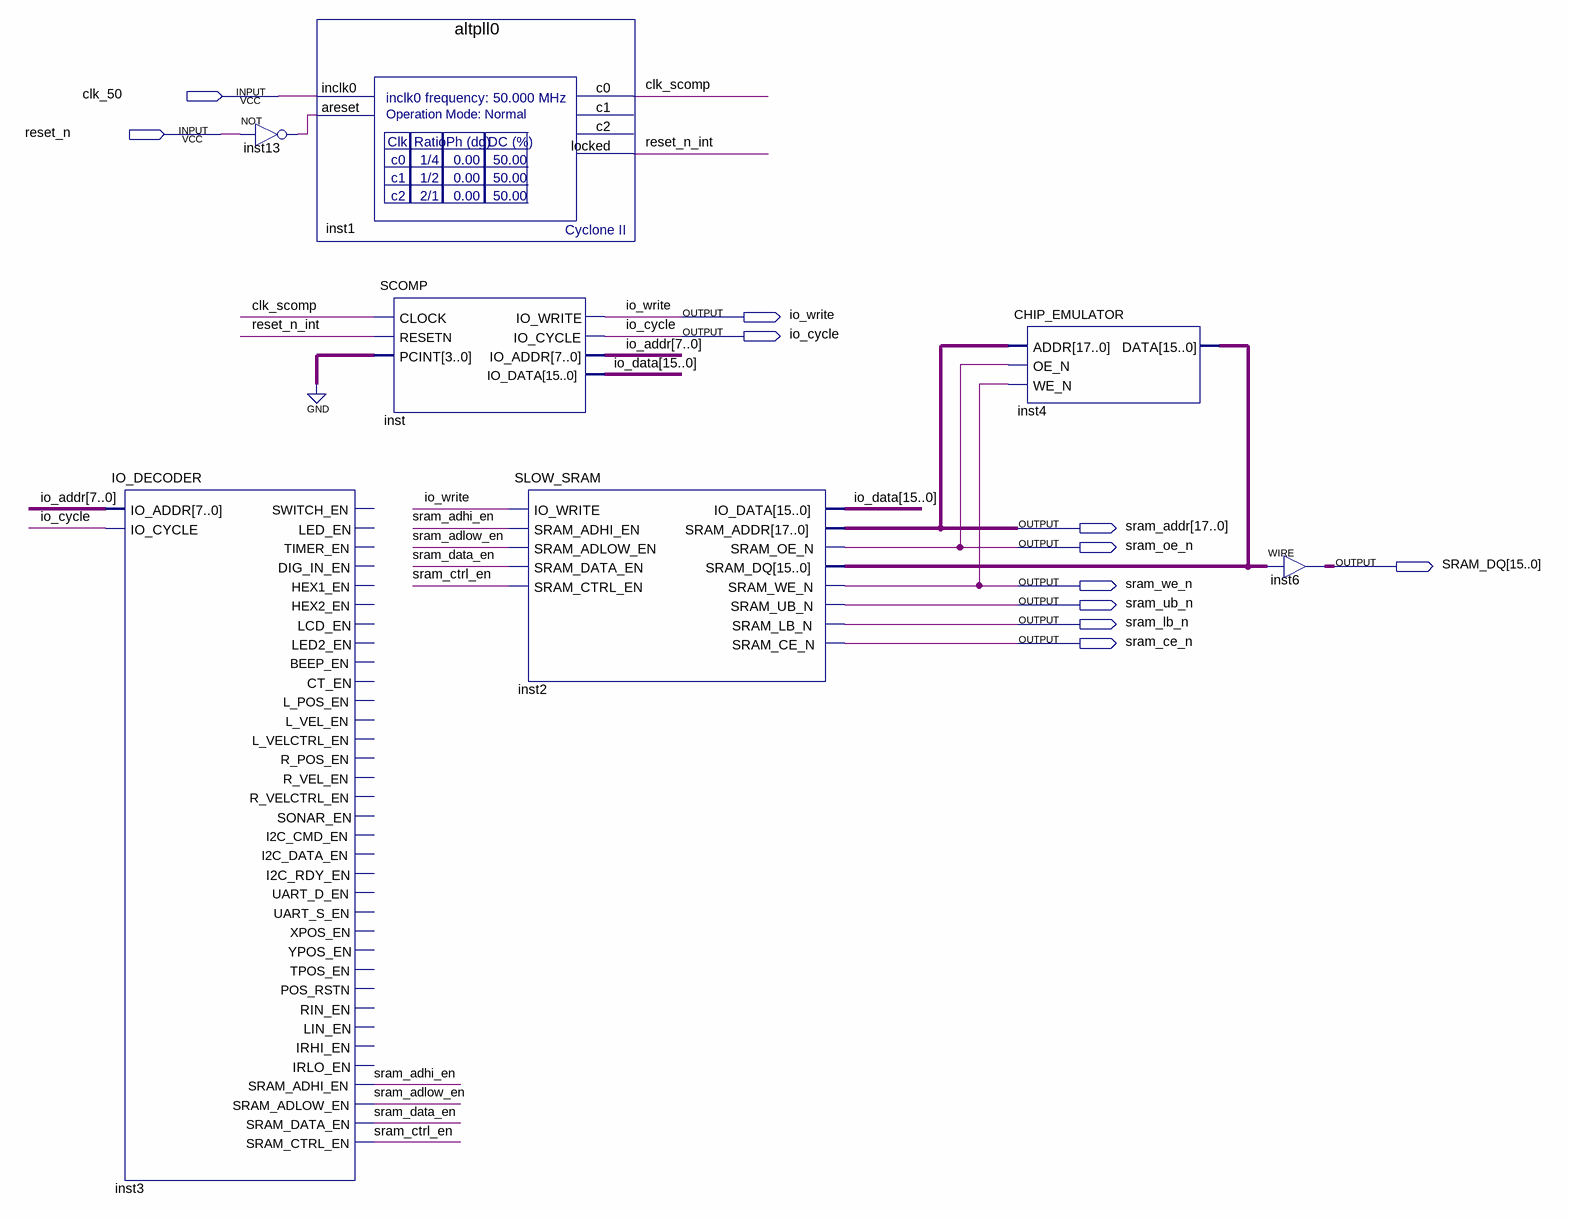
[diagram p0: schematic sheet]
// Quartus schematic SCOMP_SRAM.bdf as structural Verilog: 7 symbols, 11 pins
module SCOMP_SRAM (
  input  clk_50,
  input  reset_n,
  output io_write,
  output io_cycle,
  output [17:0] sram_addr,
  output sram_oe_n,
  output [15:0] SRAM_DQ,
  output sram_we_n,
  output sram_ub_n,
  output sram_lb_n,
  output sram_ce_n
);

  wire clk_scomp, inst13_out, reset_n_int, sram_adhi_en, sram_adlow_en, sram_ctrl_en, sram_data_en;
  wire [7:0] io_addr;
  wire [15:0] inst2_sram_dq, io_data;

  IO_DECODER inst3 (
    .IO_ADDR(io_addr), .IO_CYCLE(io_cycle), .SRAM_ADHI_EN(sram_adhi_en), .SRAM_ADLOW_EN(sram_adlow_en),
    .SRAM_DATA_EN(sram_data_en), .SRAM_CTRL_EN(sram_ctrl_en));  // open: SWITCH_EN, LED_EN, TIMER_EN, DIG_IN_EN, HEX1_EN, HEX2_EN, LCD_EN, LED2_EN, BEEP_EN, CT_EN, L_POS_EN, L_VEL_EN, L_VELCTRL_EN, R_POS_EN, R_VEL_EN, R_VELCTRL_EN, SONAR_EN, I2C_CMD_EN, I2C_DATA_EN, I2C_RDY_EN, UART_D_EN, UART_S_EN, XPOS_EN, YPOS_EN, TPOS_EN, POS_RSTN, RIN_EN, LIN_EN, IRHI_EN, IRLO_EN
  not inst13 (inst13_out, reset_n);
  altpll0 inst1 (.inclk0(clk_50), .areset(inst13_out), .c0(clk_scomp), .locked(reset_n_int));  // open: c1, c2
  SCOMP inst (
    .CLOCK(clk_scomp), .RESETN(reset_n_int), .PCINT(4'b0000), .IO_WRITE(io_write), .IO_CYCLE(io_cycle),
    .IO_ADDR(io_addr), .IO_DATA(io_data));
  SLOW_SRAM inst2 (
    .IO_WRITE(io_write), .SRAM_ADHI_EN(sram_adhi_en), .SRAM_ADLOW_EN(sram_adlow_en),
    .SRAM_DATA_EN(sram_data_en), .SRAM_CTRL_EN(sram_ctrl_en), .SRAM_ADDR(sram_addr), .SRAM_OE_N(sram_oe_n),
    .SRAM_WE_N(sram_we_n), .SRAM_UB_N(sram_ub_n), .SRAM_LB_N(sram_lb_n), .SRAM_CE_N(sram_ce_n),
    .IO_DATA(io_data), .SRAM_DQ(inst2_sram_dq));
  CHIP_EMULATOR inst4 (.ADDR(sram_addr), .OE_N(sram_oe_n), .WE_N(sram_we_n), .DATA(inst2_sram_dq));
  assign SRAM_DQ = inst2_sram_dq;  // WIRE inst6
endmodule
